# Altium schematic sheet Medida corriente.SchDoc
size A4
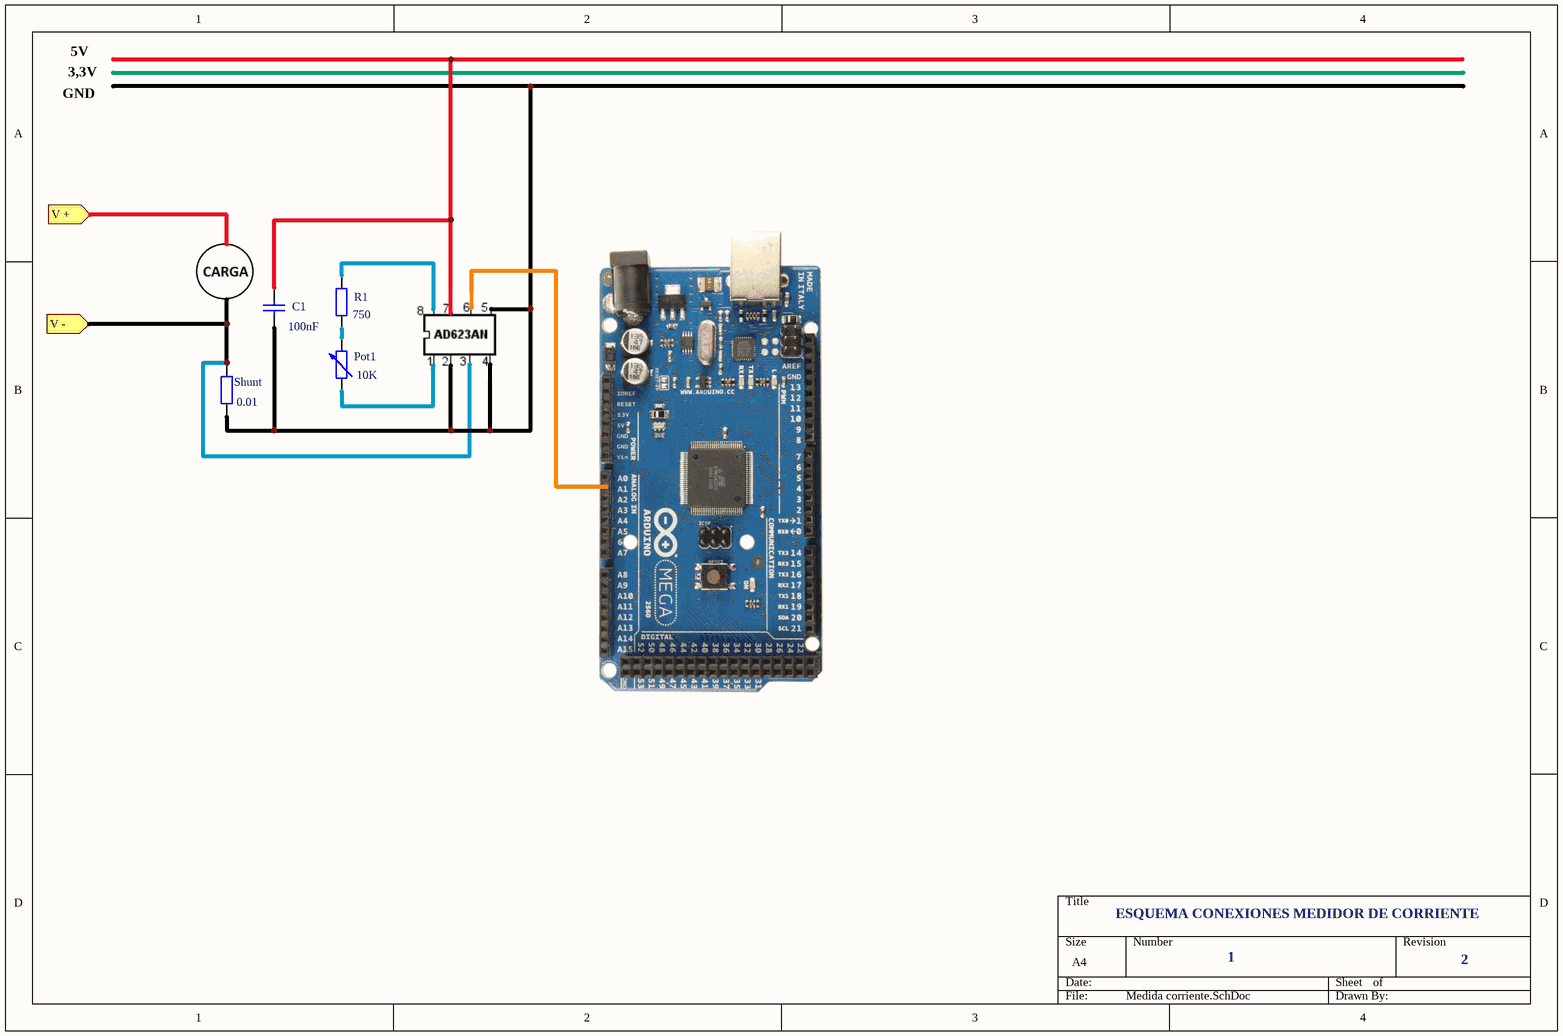
[diagram p0: Medida corriente.SchDoc]

## Parts
C1  value 100nF  [RAD-0.3]  (hidden comment: Cap)
Pot1  value 10K  [AXIAL-0.6]  (hidden comment: Res Adj2)
R1  value 750  [AXIAL-0.4]  (hidden comment: Res2)
Shunt  value 0.01  [AXIAL-0.4]  (hidden comment: Res2)

## Ports
V +, V -

## Nets
V -: Shunt.2 ; port V -
NetC1_1: C1.1 Shunt.1
NetPot1_2: Pot1.2 R1.1

Not connected (* = marked no-connect by the designer): C1 2; Pot1 1; R1 2

## Notes on the sheet
- GND
- 3,3V
- 5V
- ESQUEMA CONEXIONES MEDIDOR DE CORRIENTE
- 1
- 2

## Library data of the parts
C1 = Cap: Capacitor; Published: 8-Jun-2000; LatestRevisionDate: 17-Jul-2002; LatestRevisionNote: Re-released for DXP Platform.; PackageReference: RAD-0.3; Publisher: Altium Limited; PackageDescription: Radial Cap, Thru-Hole; 2 Leads; 0.3 in Pin Spacing
Pot1 = Res Adj2: Variable Resistor; Set Position: 0.5; Published: 8-Jun-2000; LatestRevisionDate: 17-Jul-2002; LatestRevisionNote: Re-released for DXP Platform.; PackageReference: AXIAL-0.6; Publisher: Altium Limited; PackageDescription: Axial Device, Thru-Hole; 2 Leads; 0.6 in Pin Spacing
R1 Shunt = Res2: Resistor; Published: 8-Jun-2000; LatestRevisionDate: 17-Jul-2002; LatestRevisionNote: Re-released for DXP Platform.; PackageReference: AXIAL-0.4; Publisher: Altium Limited; PackageDescription: Axial Device, Thru-Hole; 2 Leads; 0.4 in Pin Spacing